# EAGLE schematic Charger-LM317 (EAGLE 7.6.0)
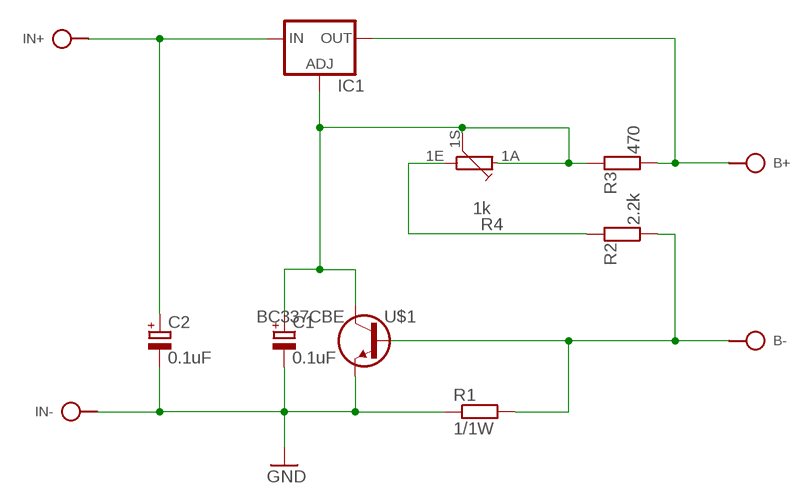
[diagram p0: schematic, sheet 1]

## Parts
B+  SPAD  [SPAD]
B-  SPAD  [SPAD]
C1  0.1uF  CPOLE5-4  [E5-4]
C2  0.1uF  CPOLE2,5-4  [E2,5-4]
IC1  LM317TL  [317TL]
IN+  SPAD  [SPAD]
IN-  SPAD  [SPAD]
R1  1/1W  R-EU_0309/12  [0309/12]
R2  2.2k  R0204/10  [0204/10]
R3  470  R0204/10  [0204/10]
R4  1k  RVPC16S  [PC16S]
U$1  BC337CBE  [TO92-CBE]

## Nets
GND: C1.- C2.- IN-.1 R1.1 U$1.E
N$1: B-.1 R1.2 R2.1 U$1.B
N$2: R2.2 R4.1E
N$3: C1.+ IC1.1(ADJ) R3.2 R4.1A R4.1S U$1.C
N$4: B+.1 IC1.2(OUT) R3.1
N$5: C2.+ IC1.3(IN) IN+.1

## Library data of the parts
B+ B- IN+ IN- = pad:SPAD
C1 C2 = c:CPOL: POLARIZED CAPACITOR, European symbol
IC1 = v-reg:LM317TL: VOLTAGE REGULATOR
R1 = rcl:R-EU_: RESISTOR, European symbol
R2 R3 = r:R: RESISTOR, European symbol
R4 = r:RV
U$1 = t:BC337